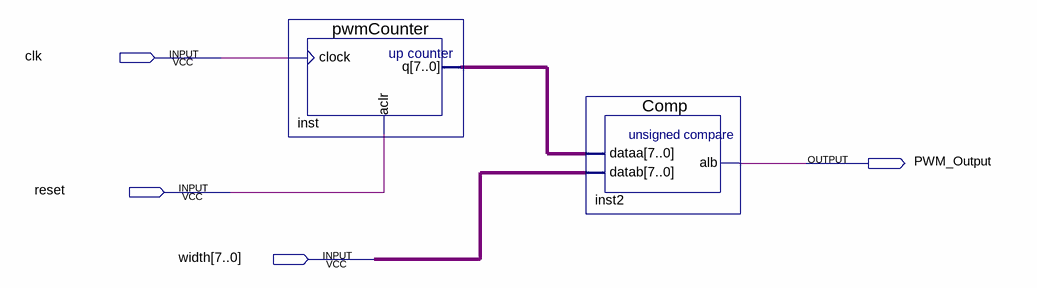
[diagram p0: schematic sheet]
// Quartus schematic PWM.bdf as structural Verilog: 2 symbols, 4 pins
module PWM (
  input  clk,
  input  reset,
  input  [7:0] width,
  output PWM_Output
);

  wire [7:0] inst_q;

  pwmCounter inst (.clock(clk), .aclr(reset), .q(inst_q));
  Comp inst2 (.dataa(inst_q), .datab(width), .alb(PWM_Output));
endmodule
